# EAGLE schematic AMS Test Board rev1 (EAGLE 9.6.2)
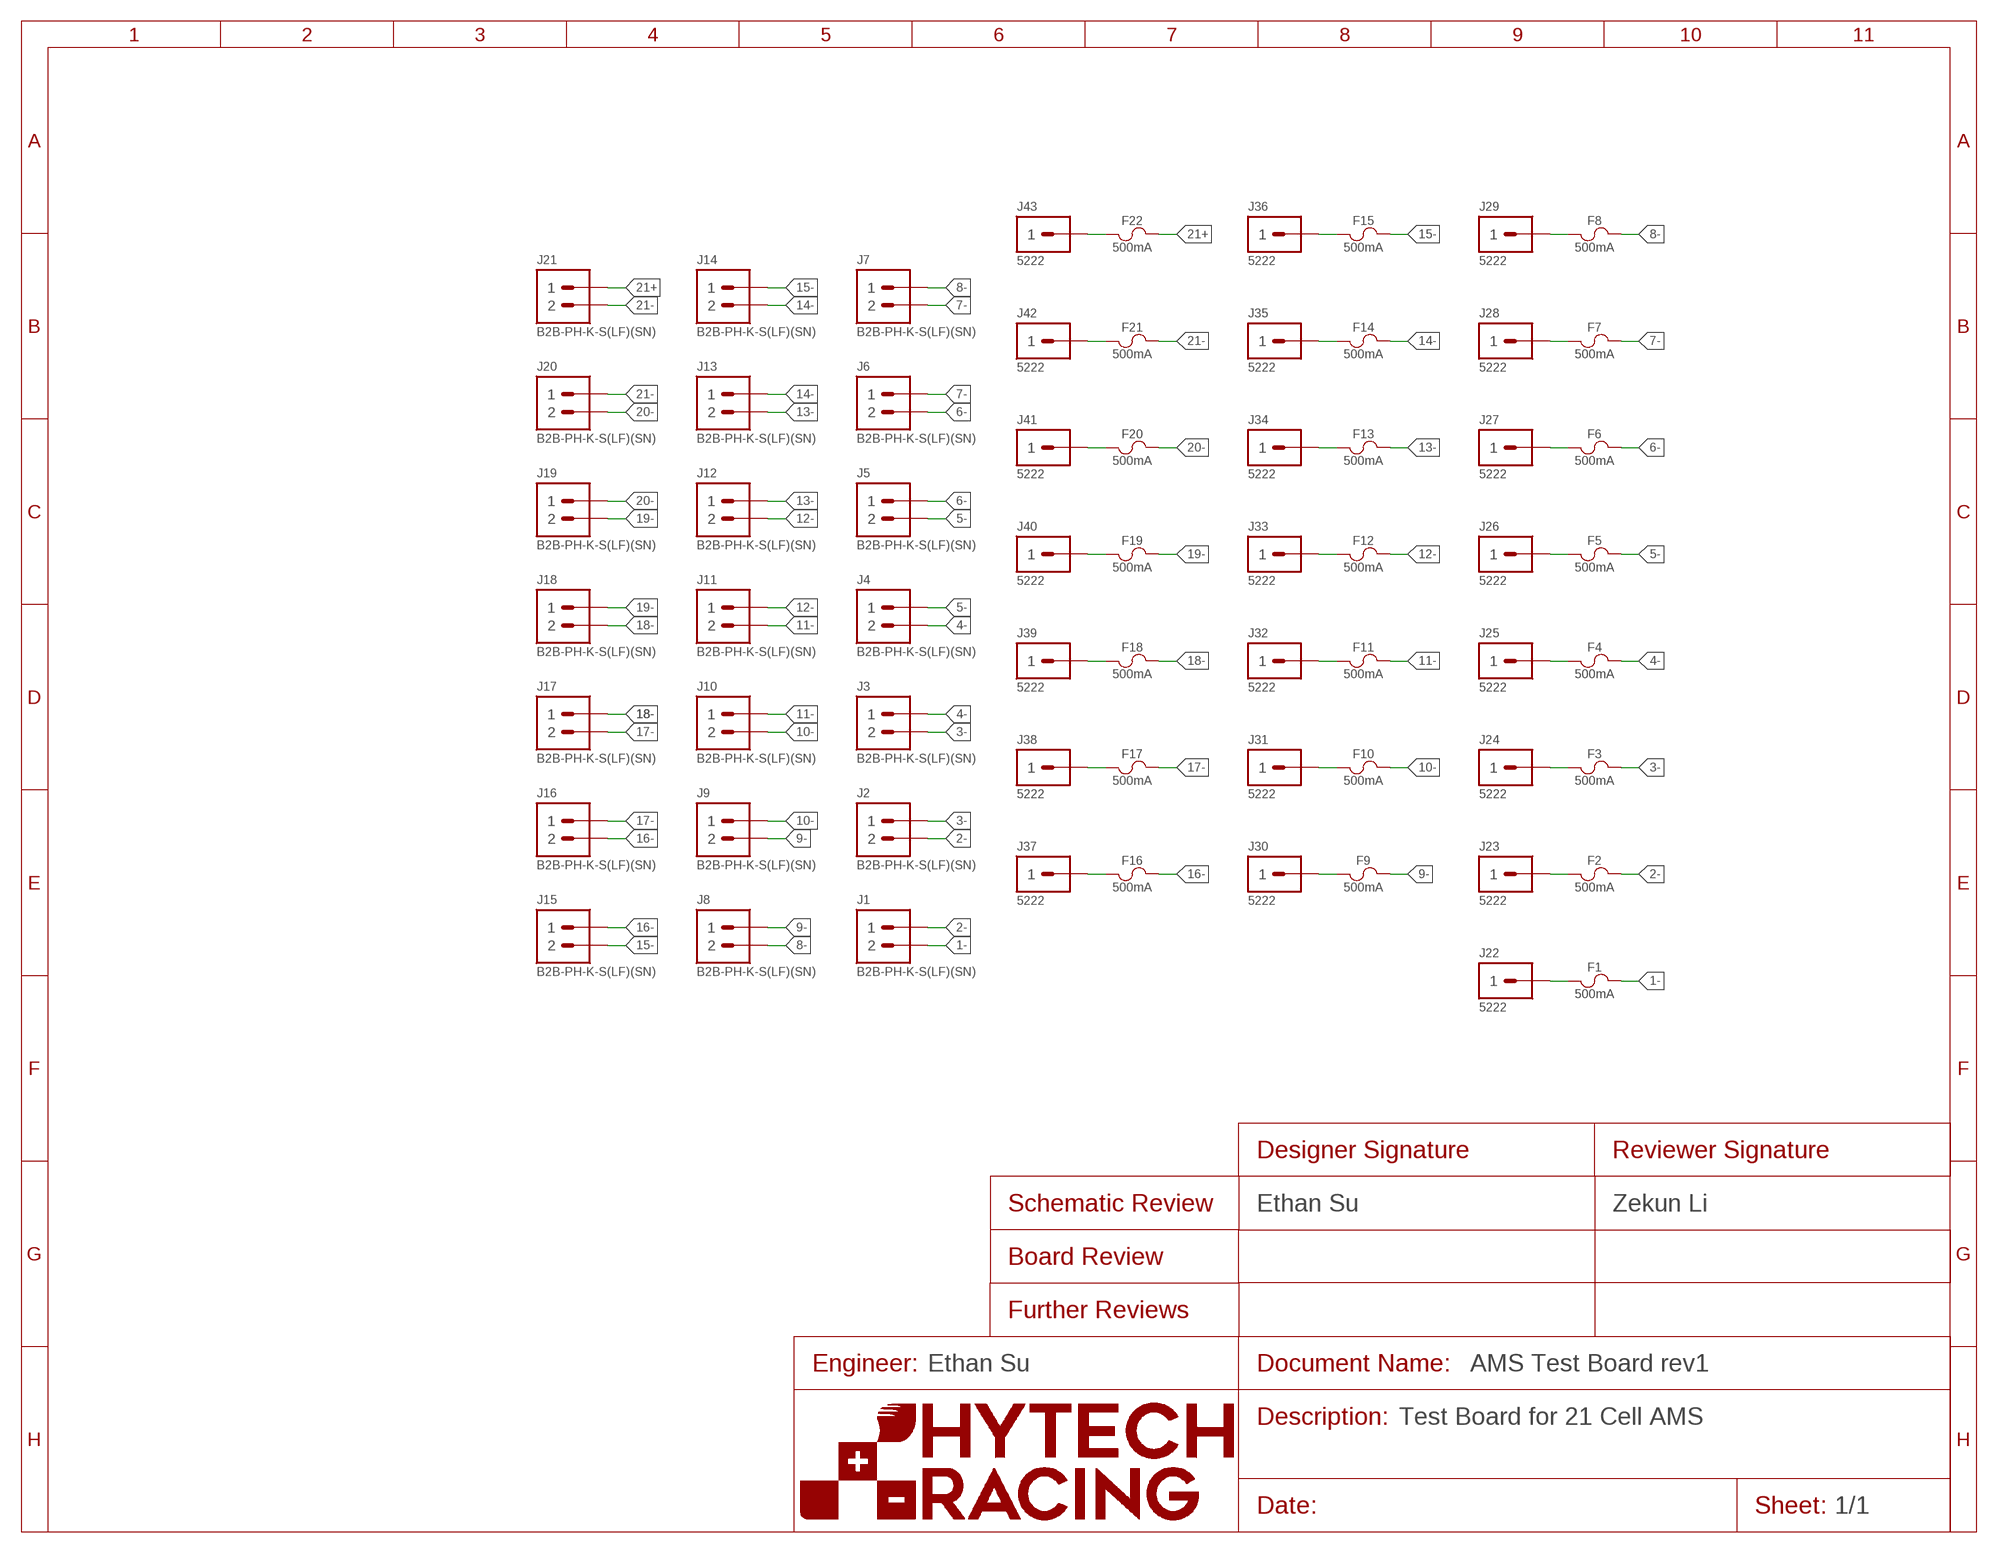
[diagram p0: schematic, sheet 1]
FRAME1 (FRAME): DESCRIPTION_1: Test Board for 21 Cell AMS; DESIGNER_SCHEMATIC: Ethan Su; ENGINEER: Ethan Su; REVIEWER_SCHEMATIC: Zekun Li

## Parts
F1  FUSE_OMF_125_.5A  [OMF_125]
F2  FUSE_OMF_125_.5A  [OMF_125]
F3  FUSE_OMF_125_.5A  [OMF_125]
F4  FUSE_OMF_125_.5A  [OMF_125]
F5  FUSE_OMF_125_.5A  [OMF_125]
F6  FUSE_OMF_125_.5A  [OMF_125]
F7  FUSE_OMF_125_.5A  [OMF_125]
F8  FUSE_OMF_125_.5A  [OMF_125]
F9  FUSE_OMF_125_.5A  [OMF_125]
F10  FUSE_OMF_125_.5A  [OMF_125]
F11  FUSE_OMF_125_.5A  [OMF_125]
F12  FUSE_OMF_125_.5A  [OMF_125]
F13  FUSE_OMF_125_.5A  [OMF_125]
F14  FUSE_OMF_125_.5A  [OMF_125]
F15  FUSE_OMF_125_.5A  [OMF_125]
F16  FUSE_OMF_125_.5A  [OMF_125]
F17  FUSE_OMF_125_.5A  [OMF_125]
F18  FUSE_OMF_125_.5A  [OMF_125]
F19  FUSE_OMF_125_.5A  [OMF_125]
F20  FUSE_OMF_125_.5A  [OMF_125]
F21  FUSE_OMF_125_.5A  [OMF_125]
F22  FUSE_OMF_125_.5A  [OMF_125]
J1  CONNECTOR-2__B2B-PH-K  [B2B-PH-K]
J2  CONNECTOR-2__B2B-PH-K  [B2B-PH-K]
J3  CONNECTOR-2__B2B-PH-K  [B2B-PH-K]
J4  CONNECTOR-2__B2B-PH-K  [B2B-PH-K]
J5  CONNECTOR-2__B2B-PH-K  [B2B-PH-K]
J6  CONNECTOR-2__B2B-PH-K  [B2B-PH-K]
J7  CONNECTOR-2__B2B-PH-K  [B2B-PH-K]
J8  CONNECTOR-2__B2B-PH-K  [B2B-PH-K]
J9  CONNECTOR-2__B2B-PH-K  [B2B-PH-K]
J10  CONNECTOR-2__B2B-PH-K  [B2B-PH-K]
J11  CONNECTOR-2__B2B-PH-K  [B2B-PH-K]
J12  CONNECTOR-2__B2B-PH-K  [B2B-PH-K]
J13  CONNECTOR-2__B2B-PH-K  [B2B-PH-K]
J14  CONNECTOR-2__B2B-PH-K  [B2B-PH-K]
J15  CONNECTOR-2__B2B-PH-K  [B2B-PH-K]
J16  CONNECTOR-2__B2B-PH-K  [B2B-PH-K]
J17  CONNECTOR-2__B2B-PH-K  [B2B-PH-K]
J18  CONNECTOR-2__B2B-PH-K  [B2B-PH-K]
J19  CONNECTOR-2__B2B-PH-K  [B2B-PH-K]
J20  CONNECTOR-2__B2B-PH-K  [B2B-PH-K]
J21  CONNECTOR-2__B2B-PH-K  [B2B-PH-K]
J22  CONNECTOR-1_5222  [5222]
J23  CONNECTOR-1_5222  [5222]
J24  CONNECTOR-1_5222  [5222]
J25  CONNECTOR-1_5222  [5222]
J26  CONNECTOR-1_5222  [5222]
J27  CONNECTOR-1_5222  [5222]
J28  CONNECTOR-1_5222  [5222]
J29  CONNECTOR-1_5222  [5222]
J30  CONNECTOR-1_5222  [5222]
J31  CONNECTOR-1_5222  [5222]
J32  CONNECTOR-1_5222  [5222]
J33  CONNECTOR-1_5222  [5222]
J34  CONNECTOR-1_5222  [5222]
J35  CONNECTOR-1_5222  [5222]
J36  CONNECTOR-1_5222  [5222]
J37  CONNECTOR-1_5222  [5222]
J38  CONNECTOR-1_5222  [5222]
J39  CONNECTOR-1_5222  [5222]
J40  CONNECTOR-1_5222  [5222]
J41  CONNECTOR-1_5222  [5222]
J42  CONNECTOR-1_5222  [5222]
J43  CONNECTOR-1_5222  [5222]

## Nets
1-: F1.2 J1.2
2-: F2.2 J1.1 J2.2
3-: F3.2 J2.1 J3.2
4-: F4.2 J3.1 J4.2
5-: F5.2 J4.1 J5.2
6-: F6.2 J5.1 J6.2
7-: F7.2 J6.1 J7.2
8-: F8.2 J7.1 J8.2
9-: F9.2 J8.1 J9.2
10-: F10.2 J9.1 J10.2
11-: F11.2 J10.1 J11.2
12-: F12.2 J11.1 J12.2
13-: F13.2 J12.1 J13.2
14-: F14.2 J13.1 J14.2
15-: F15.2 J14.1 J15.2
16-: F16.2 J15.1 J16.2
17-: F17.2 J16.1 J17.2
18-: F18.2 J17.1 J18.2
19-: F19.2 J18.1 J19.2
20-: F20.2 J19.1 J20.2
21+: F22.2 J21.1
21-: F21.2 J20.1 J21.2
N$1: F1.1 J22.1
N$2: F2.1 J23.1
N$3: F3.1 J24.1
N$4: F4.1 J25.1
N$5: F5.1 J26.1
N$6: F6.1 J27.1
N$7: F7.1 J28.1
N$8: F8.1 J29.1
N$9: F9.1 J30.1
N$10: F10.1 J31.1
N$11: F11.1 J32.1
N$12: F12.1 J33.1
N$13: F13.1 J34.1
N$14: F14.1 J35.1
N$15: F15.1 J36.1
N$16: F16.1 J37.1
N$17: F17.1 J38.1
N$18: F18.1 J39.1
N$19: F19.1 J40.1
N$20: F20.1 J41.1
N$21: F21.1 J42.1
N$22: F22.1 J43.1

## Library data of the parts
F1-F22 = HyTechDevices:FUSE_?_*: Fuse 885 Series <https://www.mouser.com/datasheet/2/240/Littelfuse_Fuse_885_Datasheet_pdf-1371443.pdf> MST 250 Series <https://www.mouser.com/datasheet/2/358/typ_MST_250-1772502.pdf> OMF 125 Series <https://www.mouser.com/datasheet/2/358/typ_OMF_125-1275954.pdf> 0686F0750-01 <https://www.mouser.com/datasheet/2/643/ds-CP-c2f-series-1291054.pdf>; CURRENT: 500mA; DKPN: 486-3694-ND; FUSE_TYPE: SMD; I2T: 0.01; MANUFACTURER: Schurter Inc.; MOPN: 693-3404.0045.11; MPN: 3404.0045.11; VOLTAGE: 125V
J1-J21 = HyTechDevices:CONNECTOR-2_?_*: 2 Pin Connector; DKPN: 455-1704-ND; MANUFACTURER: JST Sales America Inc.; MPN: B2B-PH-K-S(LF)(SN); NWRKPN: 37K9940
J22-J43 = HyTechDevices:CONNECTOR-1_?: 1 Pin Connector Pogo pin datasheet <https://www.mouser.com/datasheet/2/273/Mill-Max_03212019_807-22-001-10-020101-1545127.pdf> 5222 Spring datasheet <https://www.mouser.com/datasheet/2/215/5222-743174.pdf>; DKPN: 36-5222-ND; MANUFACTURER: Keystone Electronics; MODEL: SPRING; MOPN: 534-5222; MPN: 5222